# EAGLE design demux (EAGLE 8.5.2)
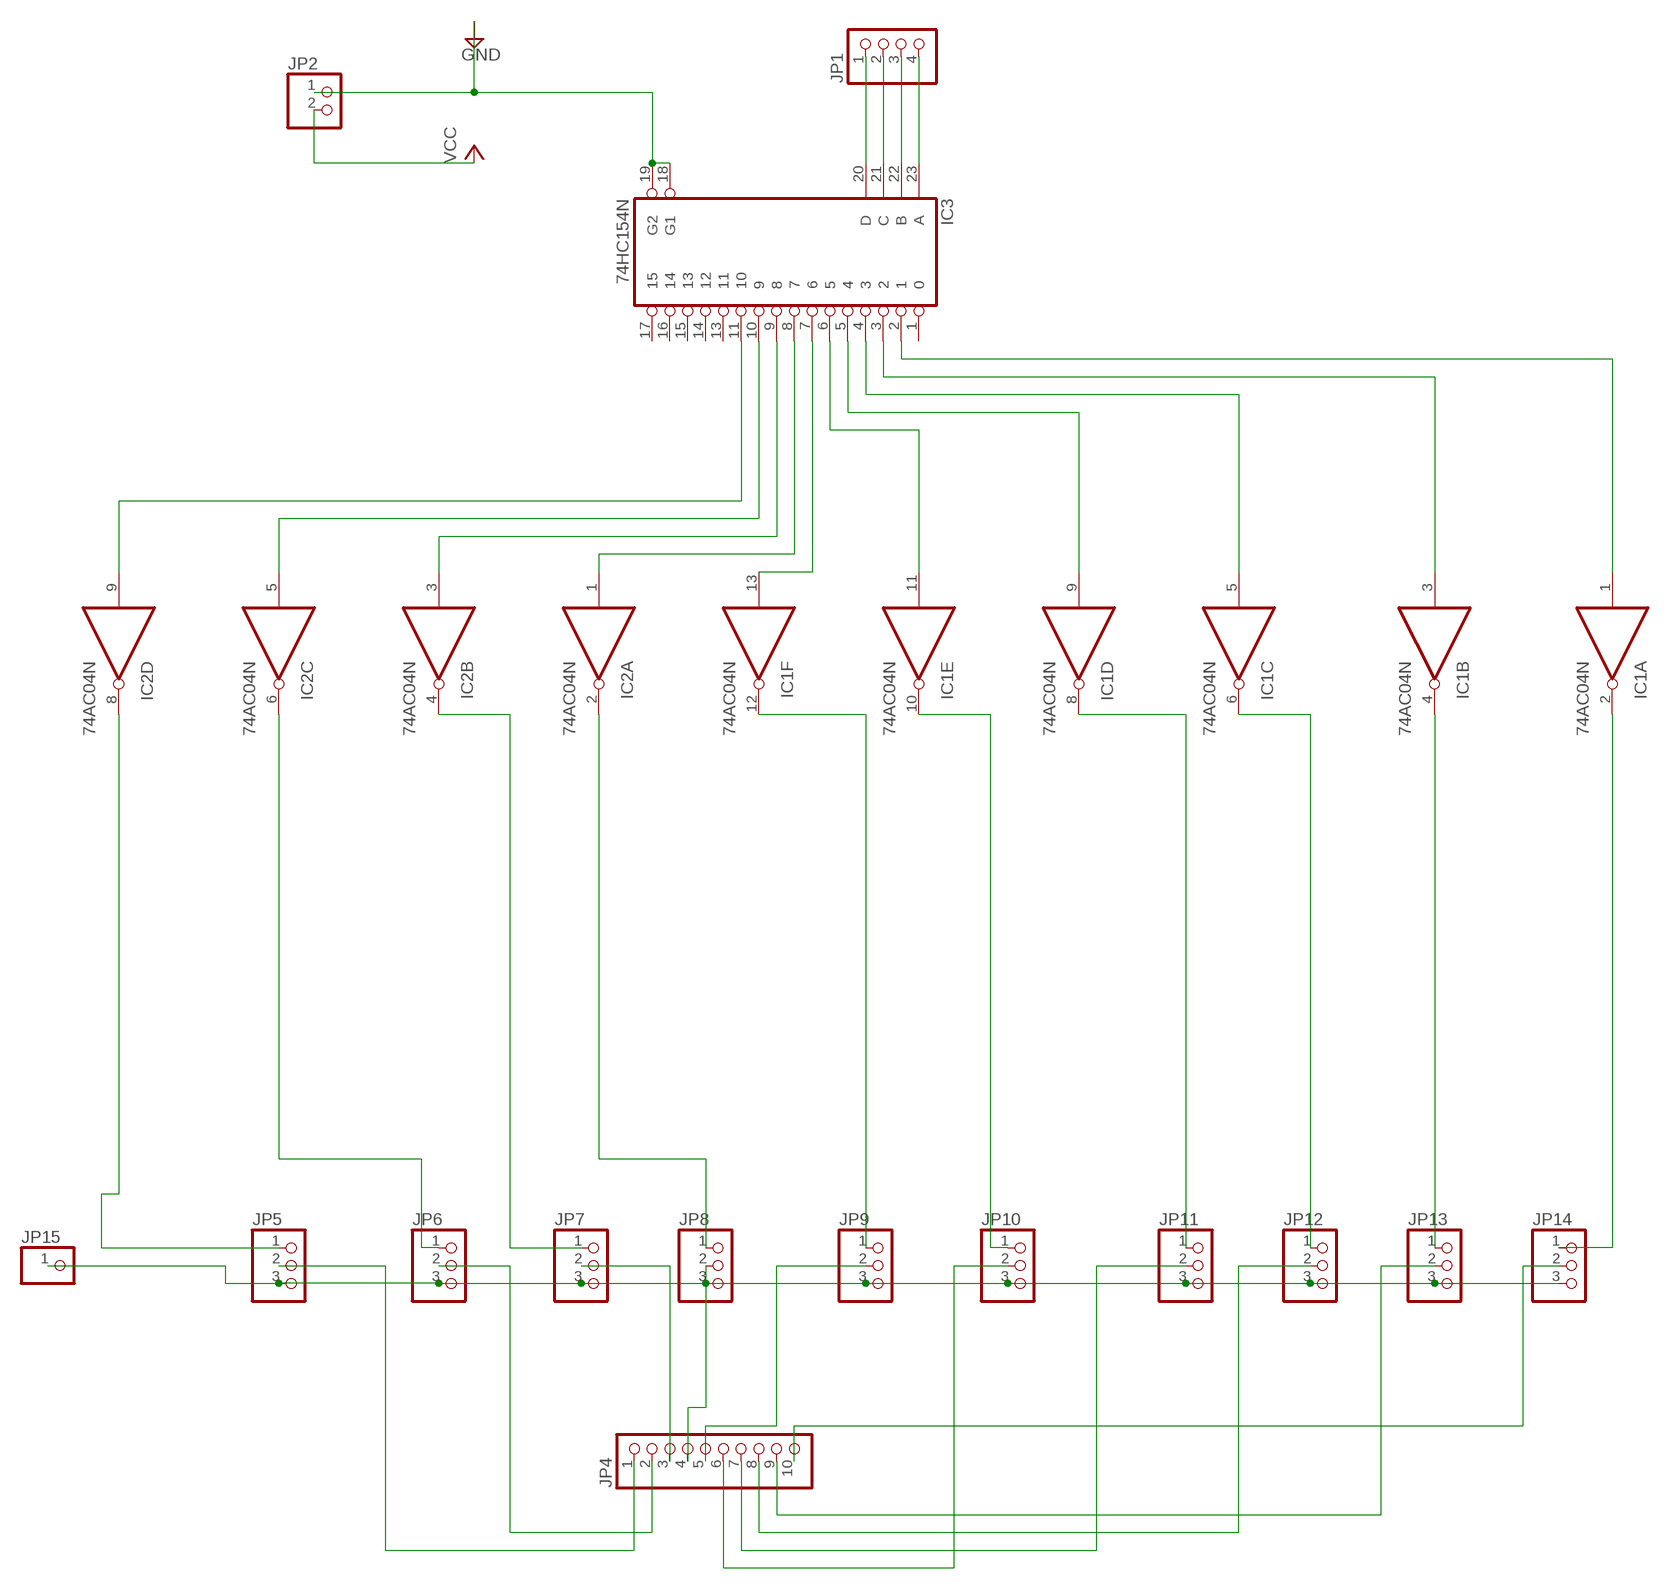
[diagram p0: schematic, sheet 1]

## Parts
IC1  74AC04N  [DIL14]
IC2  74AC04N  [DIL14]
IC3  74HC154N  [DIL24-6]
JP1  PINHD-1X4  [1X04]
JP2  PINHD-1X2  [1X02]
JP4  PINHD-1X10  [1X10]
JP5  PINHD-1X3  [1X03]
JP6  PINHD-1X3  [1X03]
JP7  PINHD-1X3  [1X03]
JP8  PINHD-1X3  [1X03]
JP9  PINHD-1X3  [1X03]
JP10  PINHD-1X3  [1X03]
JP11  PINHD-1X3  [1X03]
JP12  PINHD-1X3  [1X03]
JP13  PINHD-1X3  [1X03]
JP14  PINHD-1X3  [1X03]
JP15  PINHD-1X1  [1X01]

## Nets
GND: IC3.18(G1) IC3.19(G2) JP2.1
N$1: IC3.20(D) JP1.1
N$2: IC3.21(C) JP1.2
N$3: IC3.22(B) JP1.3
N$4: IC3.23(A) JP1.4
N$5: IC1.1(A:I) IC3.2
N$6: IC1.3(B:I) IC3.3
N$7: IC1.5(C:I) IC3.4
N$8: IC1.9(D:I) IC3.5
N$9: IC1.11(E:I) IC3.6
N$10: IC1.13(F:I) IC3.7
N$11: IC2.1(A:I) IC3.8
N$12: IC2.3(B:I) IC3.9
N$13: IC2.5(C:I) IC3.10
N$14: IC2.9(D:I) IC3.11
N$15: IC2.8(D:O) JP5.1
N$17: IC2.4(B:O) JP7.1
N$18: IC2.2(A:O) JP8.1
N$19: IC1.12(F:O) JP9.1
N$20: IC1.8(D:O) JP11.1
N$21: IC1.6(C:O) JP12.1
N$22: IC1.4(B:O) JP13.1
N$23: IC1.2(A:O) JP14.1
N$25: JP5.3 JP6.3 JP7.3 JP8.3 JP9.3 JP10.3 JP11.3 JP12.3 JP13.3 JP14.3 JP15.1
N$27: IC2.6(C:O) JP6.1
N$31: IC1.10(E:O) JP10.1
N$36: JP4.1 JP5.2
N$37: JP4.2 JP6.2
N$38: JP4.3 JP7.2
N$39: JP4.4 JP8.2
N$40: JP4.5 JP9.2
N$41: JP4.6 JP10.2
N$42: JP4.7 JP11.2
N$43: JP4.8 JP12.2
N$44: JP4.9 JP13.2
N$45: JP4.10 JP14.2
VCC: JP2.2
Unconnected: IC2.10(E:O) IC2.11(E:I) IC2.12(F:O) IC2.13(F:I) IC3.1 IC3.13 IC3.14 IC3.15 IC3.16 IC3.17

## Power pins joined to a net without a drawn wire
GND: IC1.7(P:GND) IC2.7(P:GND) IC3.12(GND)
VCC: IC1.14(P:VCC) IC2.14(P:VCC) IC3.24(VCC)

## Library data of the parts
IC1 IC2 = 74xx-eu:74*04: Hex INVERTER
IC3 = 74xx-eu:74*154: 4-line to 16-line data SELECTOR/MULTIPLEXER
JP1 = pinhead:PINHD-1X4: PIN HEADER
JP2 = pinhead:PINHD-1X2: PIN HEADER
JP4 = pinhead:PINHD-1X10: PIN HEADER
JP5-JP14 = pinhead:PINHD-1X3: PIN HEADER
JP15 = pinhead:PINHD-1X1: PIN HEADER

## Net classes
0 default: width 1 mm, clearance 0.5 mm

## Board
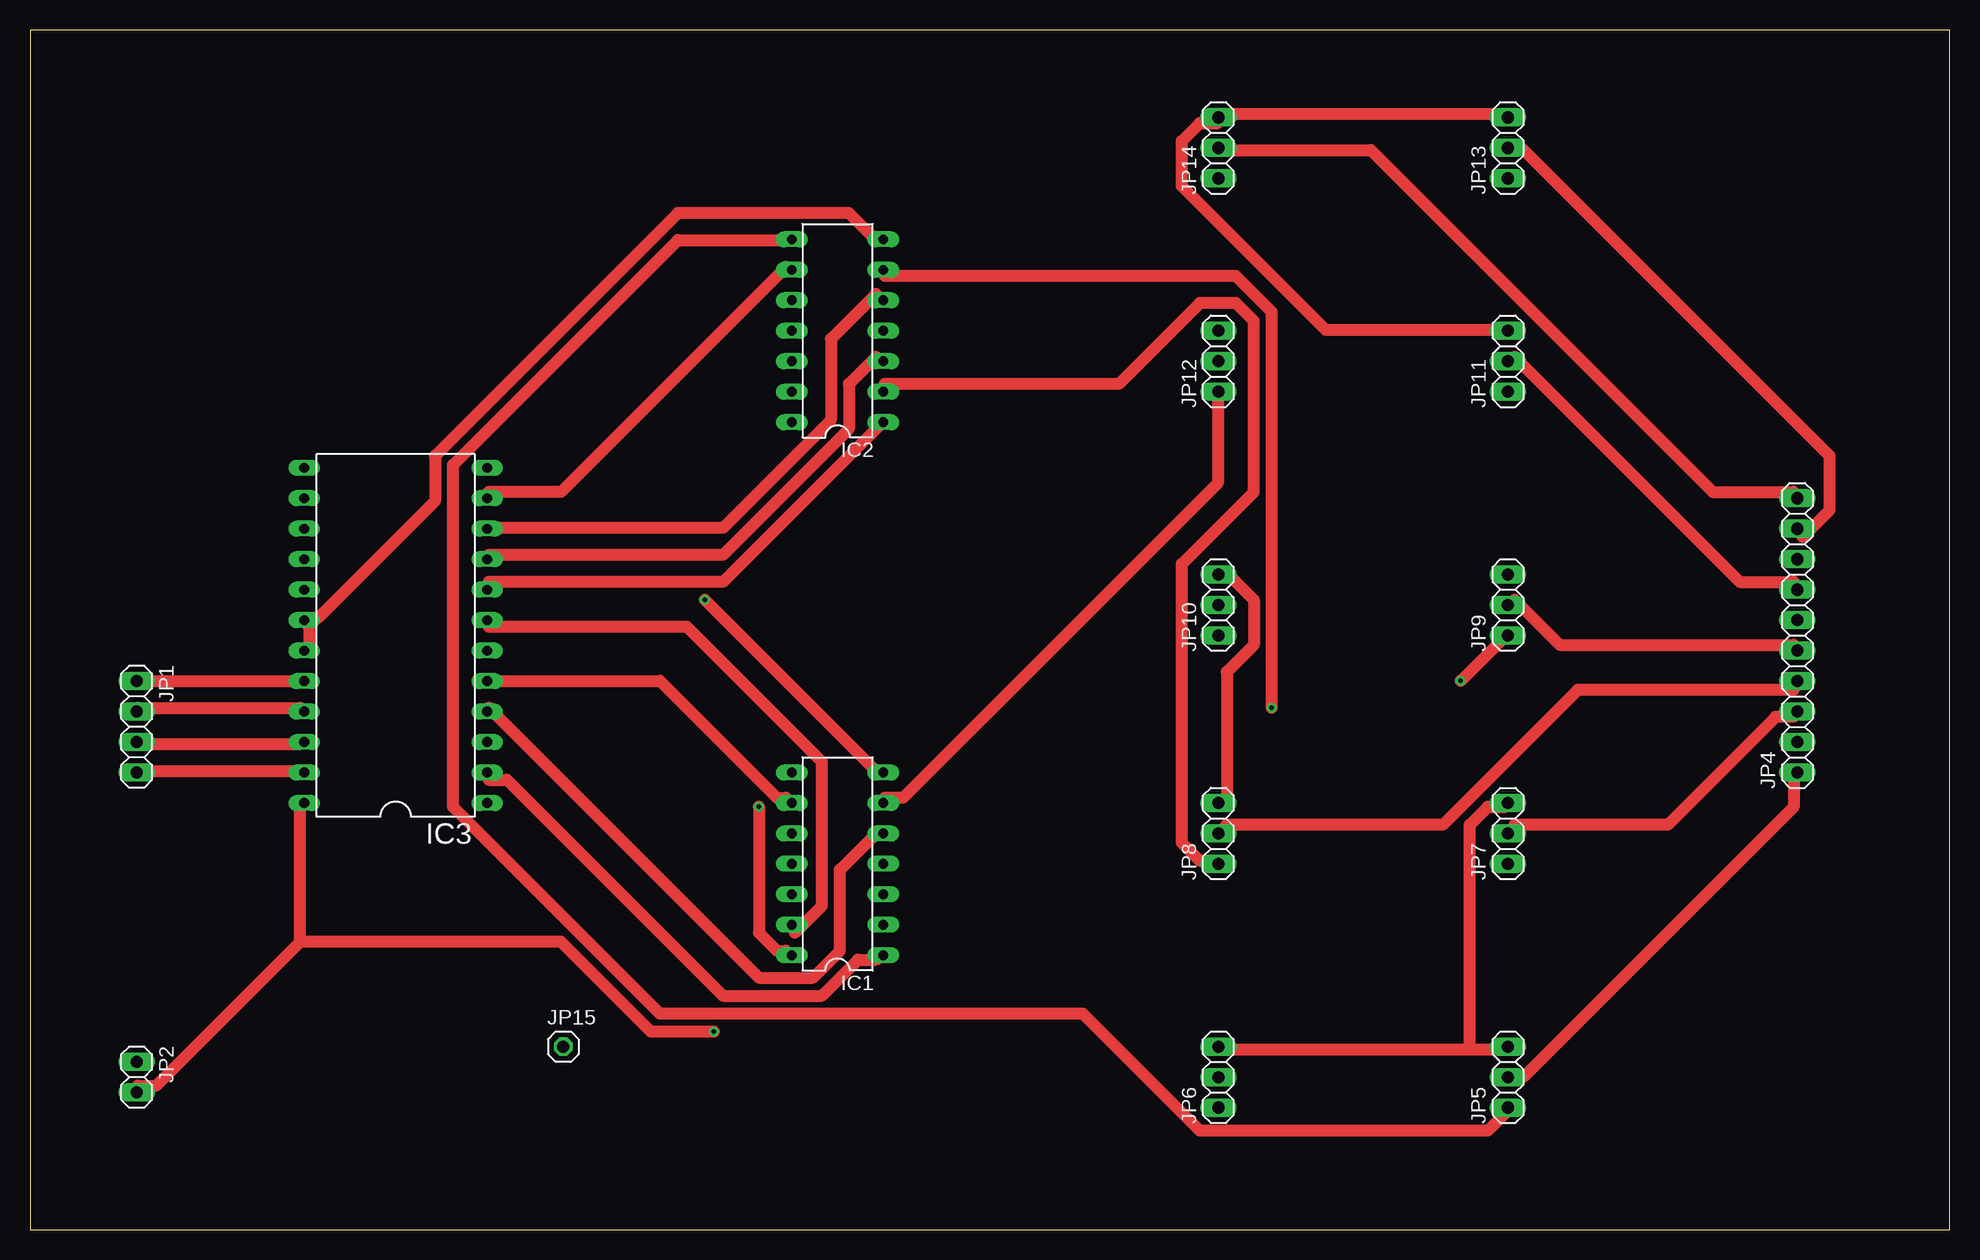
[diagram p1: board, top side]
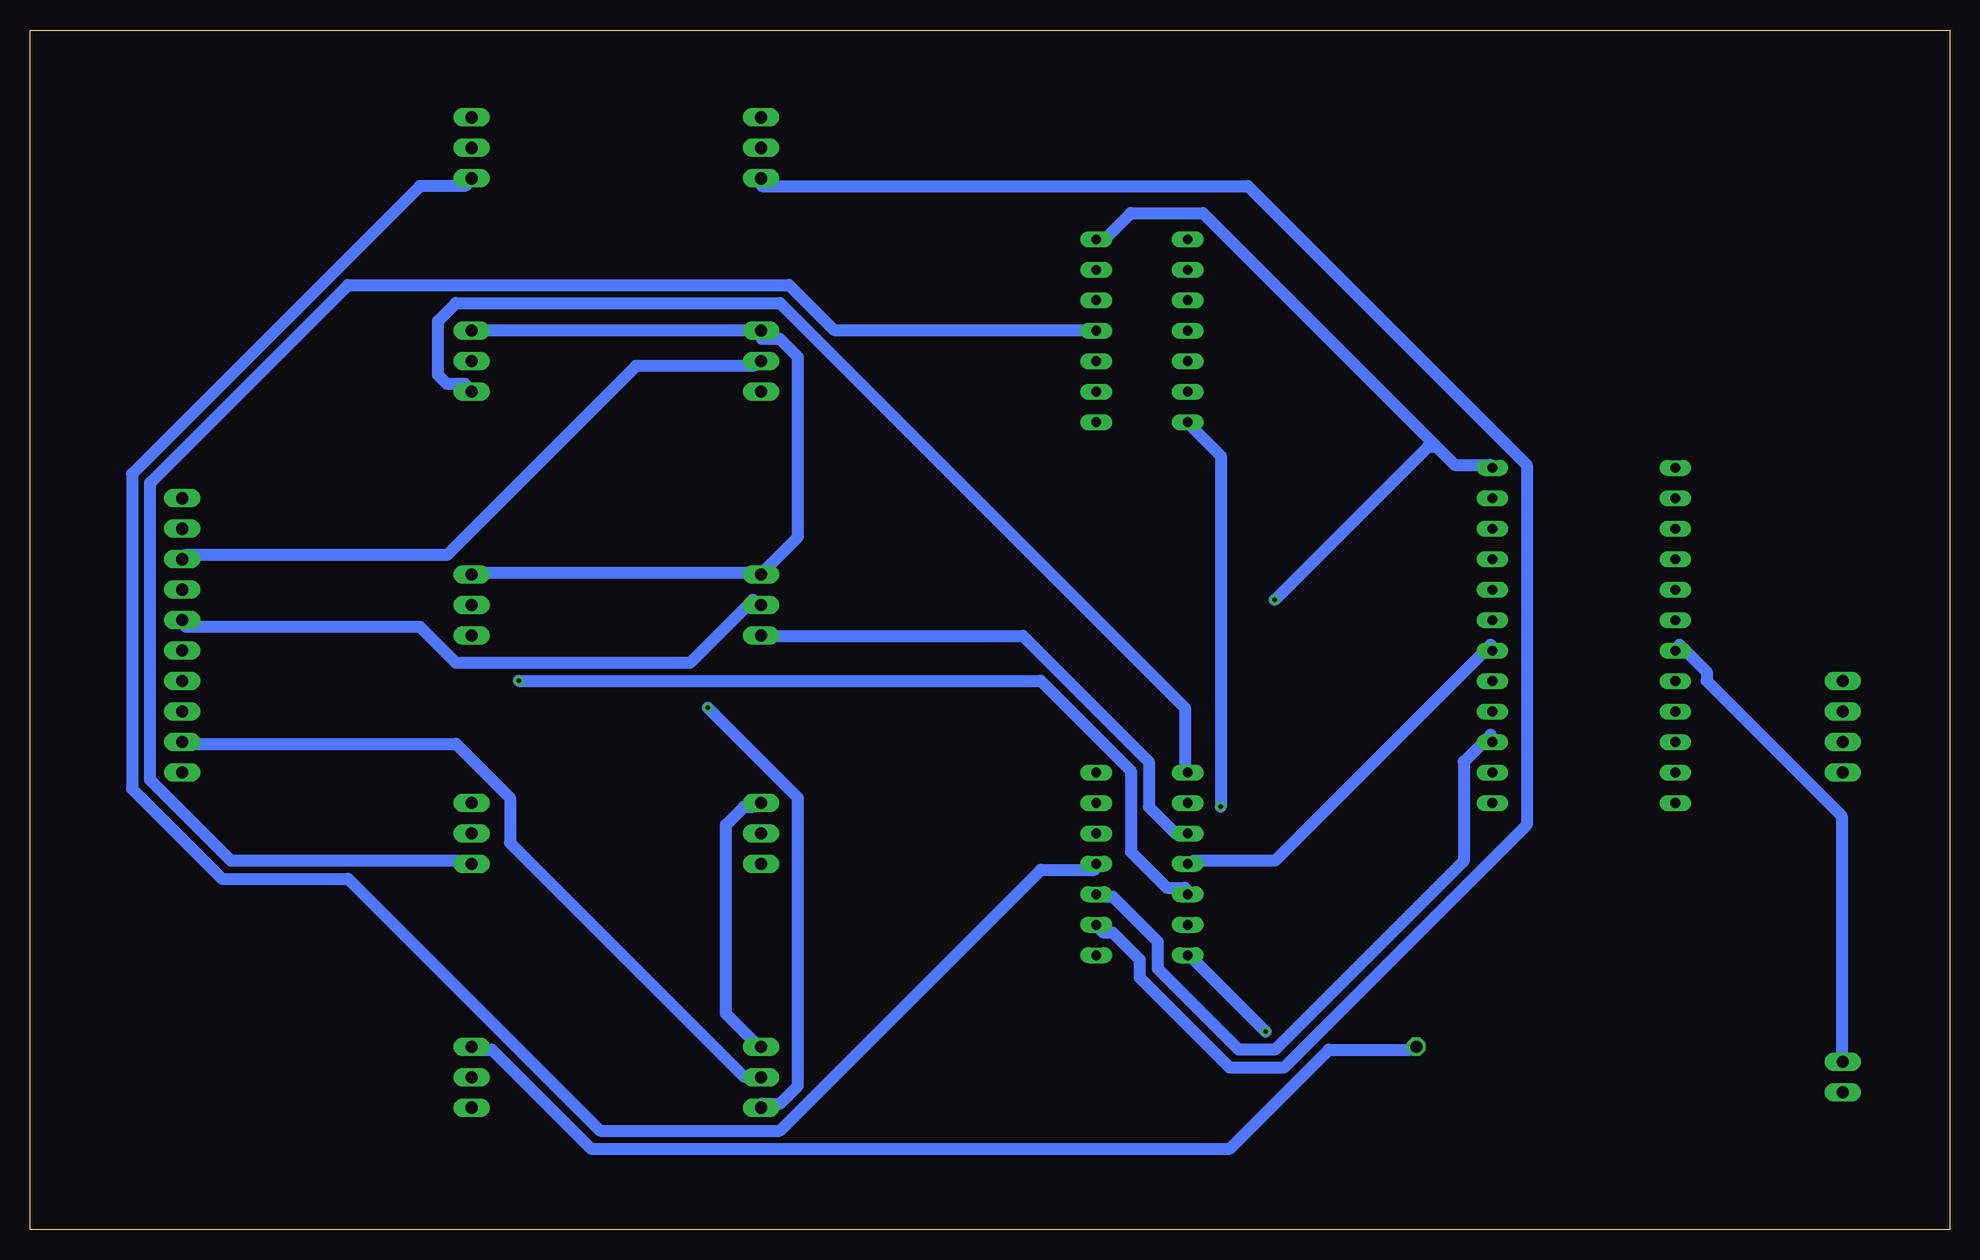
[diagram p2: board, bottom side, seen from below]

Size 160 x 100 mm. Coordinates in mm from the lower left corner, seen from the top.
Outline: 0,0 160,0 160,100 0,100 0,0
Copper layers (1*16): Top 0.035mm / dielectric 1.5mm / Bottom 0.035mm
Design rules "default": minimum track width 6mil, minimum drill 0.35mm, track to track 6mil, track to pad 6mil, pad to pad 6mil, via to via 6mil, smd to smd 6mil, copper to edge 40mil, drill to drill 6mil, minimum pad ring 10mil, minimum via ring 8mil, stop-mask expansion 4mil, vias tented up to drill 0mil, thermal gap 10mil

### Footprints (pad centres in the part's own frame; a part is rotated, then mirrored left to right if it is on the bottom)
DIL14 = drill 0.813 long: 1 -7.62,-3.81; 2 -5.08,-3.81; 3 -2.54,-3.81; 4 0,-3.81; 5 2.54,-3.81; 6 5.08,-3.81; 7 7.62,-3.81; 8 7.62,3.81; 9 5.08,3.81; 10 2.54,3.81; 11 0,3.81; 12 -2.54,3.81; 13 -5.08,3.81; 14 -7.62,3.81
DIL24-6 = drill 0.813 long: 1 -13.97,-7.62; 2 -11.43,-7.62; 3 -8.89,-7.62; 4 -6.35,-7.62; 5 -3.81,-7.62; 6 -1.27,-7.62; 7 1.27,-7.62; 8 3.81,-7.62; 9 6.35,-7.62; 10 8.89,-7.62; 11 11.43,-7.62; 12 13.97,-7.62; 13 13.97,7.62; 14 11.43,7.62; 15 8.89,7.62; 16 6.35,7.62; 17 3.81,7.62; 18 1.27,7.62; 19 -1.27,7.62; 20 -3.81,7.62; 21 -6.35,7.62; 22 -8.89,7.62; 23 -11.43,7.62; 24 -13.97,7.62
1X04 = drill 1.016 long: 1 -3.81,0; 2 -1.27,0; 3 1.27,0; 4 3.81,0
1X02 = drill 1.016 long: 1 -1.27,0; 2 1.27,0
1X10 = drill 1.016 long: 1 -11.43,0; 2 -8.89,0; 3 -6.35,0; 4 -3.81,0; 5 -1.27,0; 6 1.27,0; 7 3.81,0; 8 6.35,0; 9 8.89,0; 10 11.43,0
1X03 = drill 1.016 long: 1 -2.54,0; 2 0,0; 3 2.54,0
1X01 = drill 1.016 octagon: 1 0,0

### Placement (x,y rotation side)
IC1  67.31,30.48 90 top
IC2  67.31,74.93 90 top
IC3  30.48,49.53 90 top
JP1  8.89,41.91 270 top
JP2  8.89,12.7 270 top
JP4  147.32,49.53 90 top
JP5  123.19,12.7 90 top
JP6  99.06,12.7 90 top
JP7  123.19,33.02 90 top
JP8  99.06,33.02 90 top
JP9  123.19,52.07 90 top
JP10  99.06,52.07 90 top
JP11  123.19,72.39 90 top
JP12  99.06,72.39 90 top
JP13  123.19,90.17 90 top
JP14  99.06,90.17 90 top
JP15  44.45,15.24 0 top

### Tracks (layer width: path | path; a pad name or v marks a point on that pad's centre or on a via)
GND  (via drill 0.35)
  Top 1: IC3.19 23.25,48.75 23.25,50.25 IC3.18 23.25,51 24,51 33.75,60.75 33.75,64.5 54,84.75 68.25,84.75 70.5,82.5 IC2.7 | v56.25,52.5 70.5,38.25 IC1.7
  Bottom 1: JP2.1 9,14.25 9,34.5 20.25,45.75 20.25,46.5 22.5,48.75 IC3.19 | 42.75,65.25 62.25,84.75 68.25,84.75 70.5,82.5 IC2.7 | 42.75,65.25 41.25,63.75 38.25,63.75 IC3.12 | v56.25,52.5 43.5,65.25 42.75,65.25
N$1
  Top 1: IC3.20 22.5,45.75 9,45.75 JP1.1
N$2
  Top 1: IC3.21 22.5,43.5 9,43.5 JP1.2
N$3
  Top 1: IC3.22 22.5,40.5 9,40.5 JP1.3
N$4
  Top 1: IC3.23 22.5,38.25 9,38.25 JP1.4
N$5
  Top 1: IC1.1 70.5,22.5 69,22.5 66,19.5 57.75,19.5 39.75,37.5 38.25,37.5 IC3.2
N$6
  Bottom 1: IC1.3 70.5,27.75 69.75,27.75 66,24 66,21.75 59.25,15 56.25,15 40.5,30.75 40.5,39 38.25,41.25 IC3.3
N$7
  Top 1: IC1.5 70.5,33 67.5,30 67.5,23.25 65.25,21 60.75,21 38.25,43.5 IC3.4
N$8
  Top 1: IC1.9 63,36 62.25,36 52.5,45.75 38.25,45.75 IC3.5
N$9
  Bottom 1: IC1.11 63,30.75 56.25,30.75 38.25,48.75 IC3.6
N$10
  Top 1: IC3.7 38.25,50.25 54.75,50.25 66,39 66,27 63.75,24.75 IC1.13
N$11
  Top 1: IC3.8 38.25,54 57.75,54 70.5,66.75 IC2.1
N$12
  Top 1: IC3.9 38.25,56.25 57.75,56.25 68.25,66.75 68.25,70.5 70.5,72.75 IC2.3
N$13
  Top 1: IC3.10 38.25,58.5 57.75,58.5 66.75,67.5 66.75,74.25 70.5,78 IC2.5
N$14
  Top 1: IC3.11 38.25,61.5 44.25,61.5 63,80.25 IC2.9
N$15
  Top 1: IC2.8 63,82.5 54,82.5 35.25,63.75 35.25,35.25 52.5,18 87.75,18 97.5,8.25 121.5,8.25 123,9.75 JP5.1
N$17
  Bottom 1: IC2.4 71.25,75 93,75 96.75,78.75 133.5,78.75 150,62.25 150,37.5 143.25,30.75 123.75,30.75 JP7.1
N$18
  Top 1: IC2.2 71.25,70.5 90.75,70.5 97.5,77.25 100.5,77.25 102,75.75 102,61.5 96,55.5 96,32.25 97.5,30.75 99,30.75 JP8.1
N$19  (via drill 0.35)
  Top 1: v119.25,45.75 123,49.5 JP9.1
  Bottom 1: v119.25,45.75 75.75,45.75 68.25,38.25 68.25,31.5 65.25,28.5 63.75,28.5 IC1.12
N$20
  Bottom 1: IC1.8 63.75,38.25 63.75,43.5 97.5,77.25 124.5,77.25 126,75.75 126,71.25 125.25,70.5 123.75,70.5 JP11.1
N$21
  Top 1: IC1.6 71.25,36 72.75,36 99,62.25 99,69.75 JP12.1
N$22
  Bottom 1: IC1.4 71.25,30 75.75,30 97.5,8.25 112.5,8.25 133.5,29.25 144,29.25 151.5,36.75 151.5,63 127.5,87 123.75,87 JP13.1
N$23
  Bottom 1: IC1.2 70.5,24.75 69.75,24.75 67.5,22.5 67.5,21 60,13.5 55.5,13.5 35.25,33.75 35.25,63.75 58.5,87 99,87 JP14.1
N$25
  Top 1: JP13.3 123,93 99.75,93 JP14.3 99,92.25 97.5,92.25 96,90.75 96,87 108,75 123,75 JP11.3 | JP8.3 99.75,36 99.75,46.5 102,48.75 102,52.5 99.75,54.75 JP10.3 | 120,15 123,15 JP5.3 | 120,15 99.75,15 JP6.3 | 120,15 120,33.75 121.5,35.25 123,35.25 JP7.3
  Bottom 1: JP11.3 123,75 99.75,75 JP12.3 99,74.25 97.5,74.25 96,72.75 96,57.75 99,54.75 JP10.3 99.75,54.75 123,54.75 JP9.3 | JP15.1 45,15 51.75,15 60,6.75 113.25,6.75 121.5,15 123,15 JP5.3 | JP8.3 99.75,35.25 100.5,35.25 102,33.75 102,18 99.75,15.75 JP6.3
N$27  (via drill 0.35)
  Top 1: v103.5,43.5 103.5,76.5 100.5,79.5 71.25,79.5 IC2.6
  Bottom 1: v103.5,43.5 96,36 96,12 97.5,10.5 99,10.5 JP6.1
N$31
  Bottom 1: IC1.10 63.75,33 64.5,33 66.75,35.25 66.75,39 77.25,49.5 99,49.5 JP10.1
N$36
  Top 1: JP5.2 123.75,12.75 124.5,12.75 147,35.25 147,37.5 JP4.1
N$37
  Bottom 1: JP6.2 99.75,12.75 100.5,12.75 120,32.25 120,36 124.5,40.5 147,40.5 JP4.2
N$38
  Top 1: JP7.2 123.75,33.75 136.5,33.75 145.5,42.75 147,42.75 JP4.3
N$39
  Top 1: JP8.2 99.75,33.75 117.75,33.75 129,45 147,45 JP4.4
N$40
  Top 1: JP4.5 147,48.75 127.5,48.75 123.75,52.5 JP9.2
N$41
  Bottom 1: JP4.6 147,50.25 127.5,50.25 124.5,47.25 105,47.25 99.75,52.5 JP10.2
N$42
  Top 1: JP4.7 147,54 142.5,54 123.75,72.75 JP11.2
N$43
  Bottom 1: JP4.8 147,56.25 125.25,56.25 109.5,72 99.75,72 JP12.2
N$44
  Top 1: JP13.2 123.75,90 124.5,90 150,64.5 150,60 147.75,57.75 JP4.9
N$45
  Top 1: JP4.10 147,61.5 140.25,61.5 111.75,90 99.75,90 JP14.2
VCC  (via drill 0.35)
  Top 1: 22.5,24 22.5,35.25 IC3.24 | 22.5,24 10.5,12 9,12 JP2.2 | v60.75,35.25 60.75,24.75 62.25,23.25 63,23.25 IC1.14 | 22.5,24 44.25,24 51.75,16.5 v57,16.5
  Bottom 1: v60.75,35.25 60.75,64.5 63,66.75 IC2.14 | v57,16.5 63,22.5 IC1.14